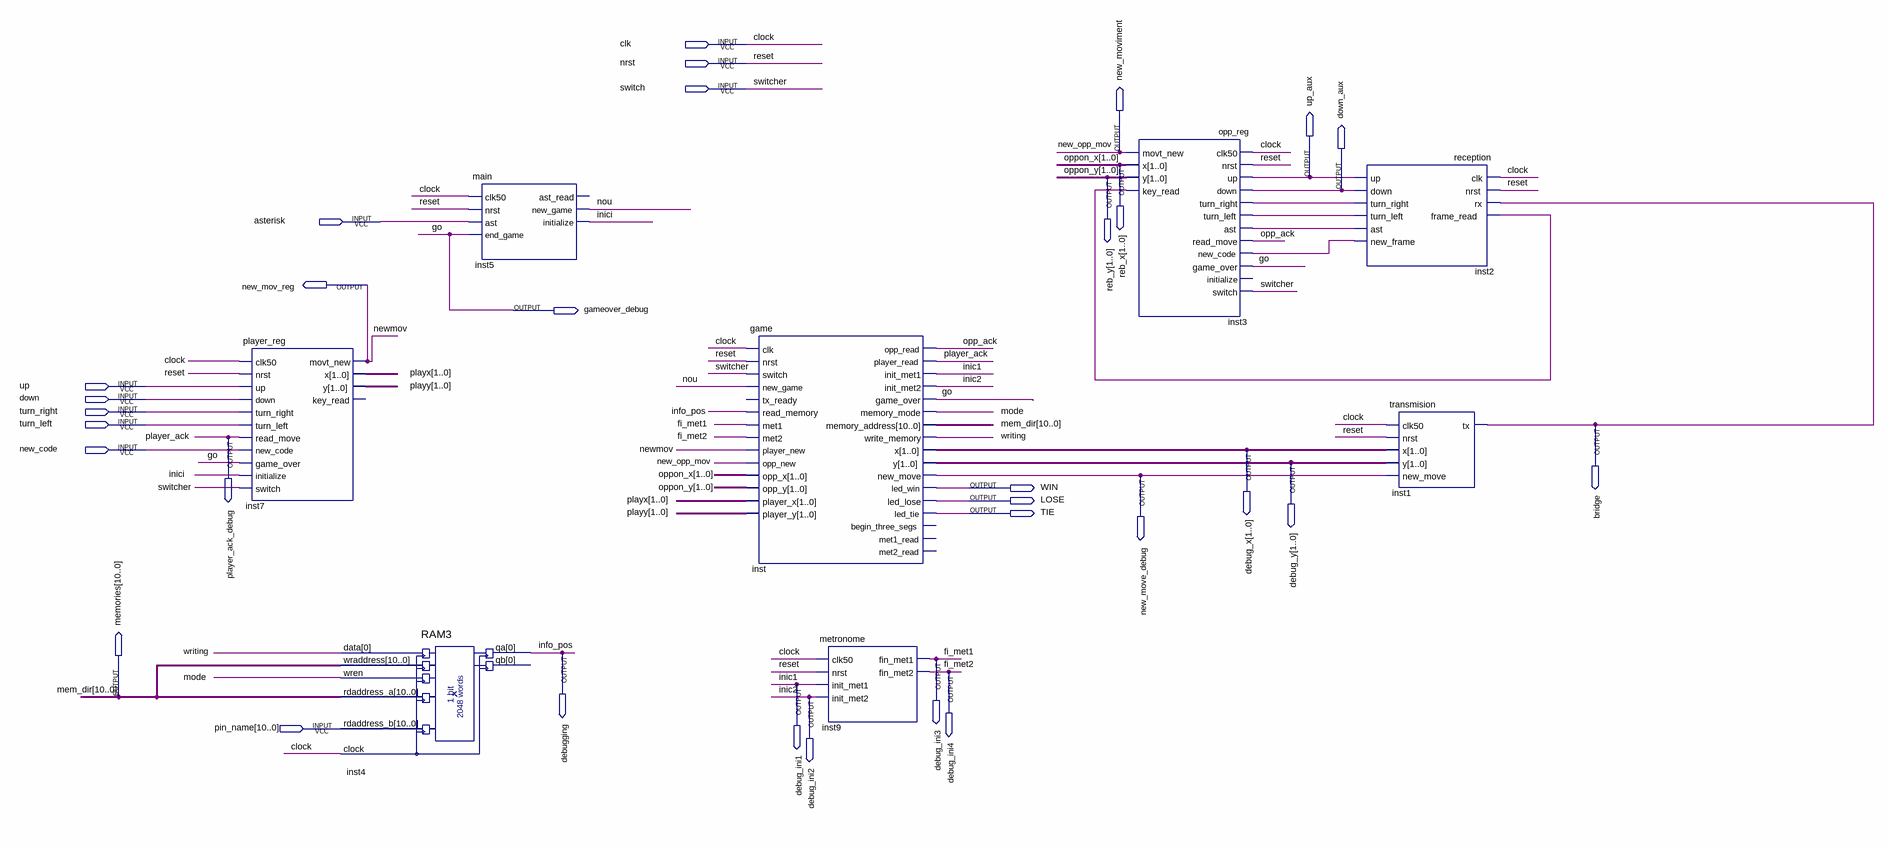
[diagram p0: schematic sheet]
// Quartus schematic testing_total.bdf as structural Verilog: 8 symbols, 31 pins
module testing_total (
  input  clk,
  input  nrst,
  input  switch,
  input  asterisk,
  input  up,
  input  down,
  input  turn_right,
  input  turn_left,
  input  new_code,
  input  [10:0] pin_name,
  output new_moviment,
  output [1:0] reb_x,
  output [1:0] reb_y,
  output up_aux,
  output down_aux,
  output new_mov_reg,
  output gameover_debug,
  output bridge,
  output player_ack_debug,
  output [1:0] debug_x,
  output [1:0] debug_y,
  output new_move_debug,
  output WIN,
  output LOSE,
  output TIE,
  output debugging,
  output debug_ini3,
  output debug_ini4,
  output debug_ini1,
  output [10:0] memories,
  output debug_ini2
);

  wire inici, inst2_ast, inst2_new_frame, inst2_turn_left, inst2_turn_right, inst3_key_read, mode, nou,
       opp_ack, writing;
  wire [1:0] playx, playy;

  player_reg inst7 (
    .clk50(clk), .nrst(nrst), .up(up), .down(down), .turn_right(turn_right), .turn_left(turn_left),
    .read_move(player_ack_debug), .new_code(new_code), .game_over(gameover_debug), .initialize(inici),
    .switch(switch), .movt_new(new_mov_reg), .x(playx), .y(playy));  // open: key_read
  RAM3 inst4 (
    .data(writing), .wraddress(memories), .wren(mode), .rdaddress_a(memories), .rdaddress_b(pin_name),
    .clock(clk), .qa(debugging));  // open: qb
  main inst5 (
    .clk50(clk), .nrst(nrst), .ast(asterisk), .end_game(gameover_debug), .new_game(nou), .initialize(inici));  // open: ast_read
  game inst (
    .clk(clk), .nrst(nrst), .switch(switch), .new_game(nou), .read_memory(debugging), .met1(debug_ini3),
    .met2(debug_ini4), .player_new(new_mov_reg), .opp_new(new_moviment), .opp_x(reb_x), .opp_y(reb_y),
    .player_x(playx), .player_y(playy), .opp_read(opp_ack), .player_read(player_ack_debug),
    .init_met1(debug_ini1), .init_met2(debug_ini2), .game_over(gameover_debug), .memory_mode(mode),
    .memory_address(memories), .write_memory(writing), .x(debug_x), .y(debug_y), .new_move(new_move_debug),
    .led_win(WIN), .led_lose(LOSE), .led_tie(TIE));  // open: tx_ready, begin_three_segs, met1_read, met2_read
  metronome inst9 (
    .clk50(clk), .nrst(nrst), .init_met1(debug_ini1), .init_met2(debug_ini2), .fin_met1(debug_ini3),
    .fin_met2(debug_ini4));
  opp_reg inst3 (
    .clk50(clk), .nrst(nrst), .up(up_aux), .down(down_aux), .turn_right(inst2_turn_right),
    .turn_left(inst2_turn_left), .ast(inst2_ast), .read_move(opp_ack), .new_code(inst2_new_frame),
    .game_over(gameover_debug), .switch(switch), .movt_new(new_moviment), .x(reb_x), .y(reb_y),
    .key_read(inst3_key_read));  // open: initialize
  reception inst2 (
    .clk(clk), .nrst(nrst), .rx(bridge), .frame_read(inst3_key_read), .up(up_aux), .down(down_aux),
    .turn_right(inst2_turn_right), .turn_left(inst2_turn_left), .ast(inst2_ast), .new_frame(inst2_new_frame));
  transmision inst1 (.clk50(clk), .nrst(nrst), .new_move(new_move_debug), .x(debug_x), .y(debug_y), .tx(bridge));

  // Other names for the same wires on the sheet: clock = clk; fi_met1 = debug_ini3; fi_met2 = debug_ini4;
  //   go = gameover_debug; info_pos = debugging; inic1 = debug_ini1; inic2 = debug_ini2; mem_dir[10:0] = memories;
  //   newmov = new_mov_reg; new_opp_mov = new_moviment; oppon_x[1:0] = reb_x; oppon_y[1:0] = reb_y;
  //   player_ack = player_ack_debug; reset = nrst; switcher = switch
endmodule
